# Altium schematic sheet [09] - ETHERNET.SchDoc
size A3; DocumentNumber: 9; SheetNumber: 9; SheetTotal: 18
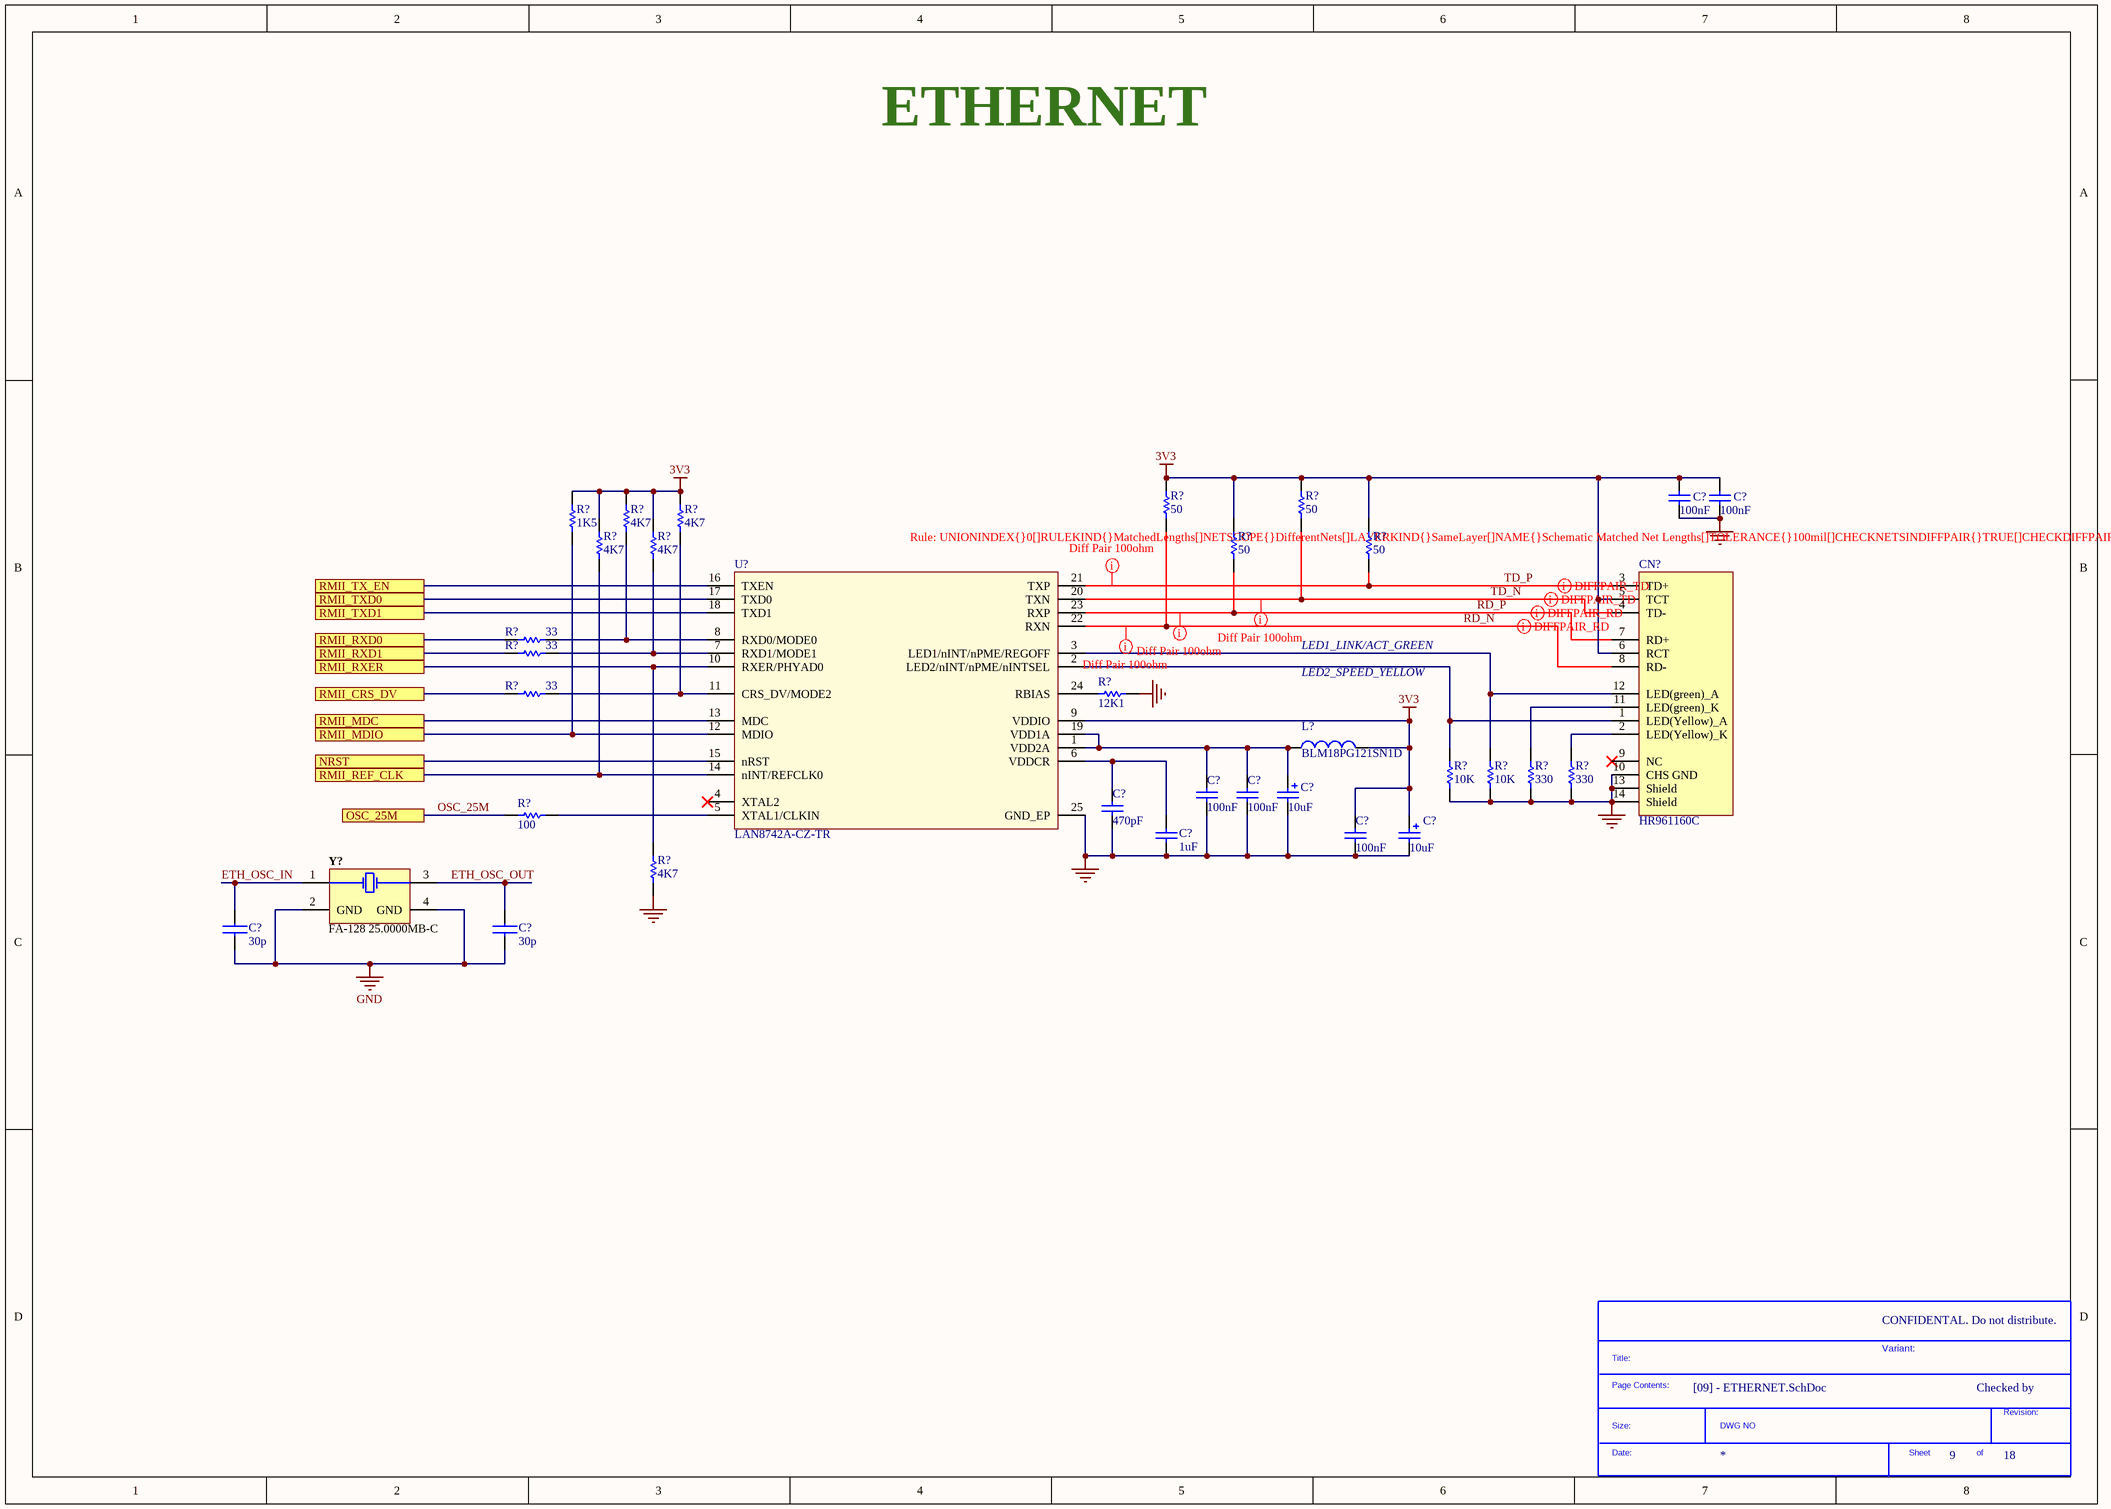
[diagram p0: [09] - ETHERNET.SchDoc]

## Parts
(Parts that share a designator on the sheet are numbered #1, #2 ... from top to bottom, then left to right.)
*  SDTitleBlock  (value not drawn)  (graphical)
C?#1  100nF  [0402C]
C?#2  100nF  [0402C]
C?#3  10uF  [TAN-A]
C?#4  100nF  [0402C]
C?#5  100nF  [0402C]
C?#6  470pF  [0402C]
C?#7  10uF  [TAN-A]
C?#8  1uF  [0603C]
C?#9  100nF  [0402C]
C?#10  30p  [C0402]
C?#11  30p  [C0402]
CN?  HR961160C  [RJ45_HR961160C]
L?  BLM18PG121SN1D  [0603L]
R?#1  50  [0402R]
R?#2  50  [0402R]
R?#3  1K5  [0402R]
R?#4  4K7  [0402R]
R?#5  4K7  [0402R]
R?#6  50  [0402R]
R?#7  50  [0402R]
R?#8  4K7  [0402R]
R?#9  4K7  [0402R]
R?#10  33  [0402R]
R?#11  33  [0402R]
R?#12  12K1  [0603R]
R?#13  33  [0402R]
R?#14  10K  [0402R]
R?#15  10K  [0402R]
R?#16  330  [0402R]
R?#17  330  [0402R]
R?#18  100  [0402R]
R?#19  4K7  [0402R]
U?  LAN8742A-CZ-TR  [QFN24_0R5_4X4]
Y?  FA-128 25.0000MB-C  [EPSON-FA-128_V]

## Ports
NRST, OSC_25M, RMII_CRS_DV, RMII_MDC, RMII_MDIO, RMII_REF_CLK, RMII_RXD0, RMII_RXD1, RMII_RXER, RMII_TX_EN, RMII_TXD0, RMII_TXD1

## Nets
3V3: C?#1.2 C?#2.2 C?#7.1 C?#9.2 CN?.5(TCT) CN?.6(RCT) L?.2 R?#1.1 R?#2.1 R?#3.2 R?#4.2 R?#5.2 R?#6.1 R?#7.1 R?#8.2 R?#9.2 U?.9(VDDIO)
GND: C?#1.1 C?#2.1 C?#3.2 C?#4.1 C?#5.1 C?#6.1 C?#7.2 C?#8.1 C?#9.1 C?#10.2 C?#11.2 CN?.10(CHS_GND) CN?.13(Shield) CN?.14(Shield) R?#12.2 R?#14.1 R?#15.1 R?#16.1 R?#17.1 R?#19.1 U?.25(GND_EP) Y?.2(GND) Y?.4(GND)
ETH_OSC_IN: C?#10.1 Y?.1(X1)
ETH_OSC_OUT: C?#11.1 Y?.3(X2)
NRST: U?.15(nRST) ; port NRST
OSC_25M: R?#18.1 ; port OSC_25M
RD_N: CN?.8(RD-) R?#1.2 U?.22(RXN)
RD_P: CN?.7(RD+) R?#6.2 U?.23(RXP)
RMII_CRS_DV: R?#13.2 ; port RMII_CRS_DV
RMII_MDC: U?.13(MDC) ; port RMII_MDC
RMII_MDIO: R?#3.1 U?.12(MDIO) ; port RMII_MDIO
RMII_REF_CLK: R?#8.1 U?.14(nINT/REFCLK0) ; port RMII_REF_CLK
RMII_RXD0: R?#10.2 ; port RMII_RXD0
RMII_RXD1: R?#11.2 ; port RMII_RXD1
RMII_RXER: R?#19.2 U?.10(RXER/PHYAD0) ; port RMII_RXER
RMII_TX_EN: U?.16(TXEN) ; port RMII_TX_EN
RMII_TXD0: U?.17(TXD0) ; port RMII_TXD0
RMII_TXD1: U?.18(TXD1) ; port RMII_TXD1
TD_N: CN?.4(TD-) R?#2.2 U?.20(TXN)
TD_P: CN?.3(TD+) R?#7.2 U?.21(TXP)
NetC?#3_1: C?#3.1 C?#4.2 C?#5.2 L?.1 U?.1(VDD2A) U?.19(VDD1A)
NetC?#6_2: C?#6.2 C?#8.2 U?.6(VDDCR)
NetCN?_1: CN?.1(LED(Yellow)_A) R?#14.2 U?.2(LED2/nINT/nPME/nINTSEL)
NetCN?_2: CN?.2(LED(Yellow)_K) R?#17.2
NetCN?_11: CN?.11(LED(green)_K) R?#16.2
NetCN?_12: CN?.12(LED(green)_A) R?#15.2 U?.3(LED1/nINT/nPME/REGOFF)
NetR?#4_1: R?#4.1 R?#10.1 U?.8(RXD0/MODE0)
NetR?#5_1: R?#5.1 R?#13.1 U?.11(CRS_DV/MODE2)
NetR?#9_1: R?#9.1 R?#11.1 U?.7(RXD1/MODE1)
NetR?#12_1: R?#12.1 U?.24(RBIAS)
NetR?#18_2: R?#18.2 U?.5(XTAL1/CLKIN)

Not connected (* = marked no-connect by the designer): CN? 9(NC)*; U? 4(XTAL2)*

## Layout directives
differential pair: RD_N, RD_P, TD_N, TD_P
rule Matched Net Lengths [Tolerance = 100mil]: RD_N, RD_P, TD_N, TD_P

## Notes on the sheet
- ETHERNET
- LED1_LINK/ACT_GREEN
- LED2_SPEED_YELLOW
- CONFIDENTAL. Do not distribute.
- CLOCKS (CPU & PCIE)
- Variant:
- Checked by
- (in symbol SDTitleBlock) Title:; Page Contents:; Revision:; Size:; DWG NO; Date:; Sheet; of

## Library data of the parts
C?#1 C?#2 C?#4 C?#5 C?#9 = Cap_100nF_X7R_10%_0402: Capacitor,100nF,16V,X7R,10%,0402,YAGEO; Manuf_Part_1: CC0402KRX7R7BB104; Revision: July-2002: Re-released for DXP Platform.; Value: 100nF; Order: CC0402KRX7R7BB104; Manuf_1: YAGEO
C?#3 C?#7 = Cap_10uF_POL_10%_TANA: Polarized Capacitor,10uF,10V,10%,typeA,VISHAY; Manuf_Part_1: 293D106X9010A2TE3; Revision: July-2002: Re-released for DXP Platform.; Value: 10uF; Manuf_1: VISHAY; Order: *; ECCN_US/EU: n/a
C?#6 = Cap_470pF_X7R_10%_0402: Capacitor,470pF,16V,X7R,10%,0402,YAGEO; Manuf_Part_1: 0402YC471KAT4A; Manuf_1: AVX; Revision: July-2002: Re-released for DXP Platform.; Value: 470pF; Order: 0402YC471KAT4A; ECCN_US/EU: n/a
C?#8 = Cap_1uF_X5R_10%_0603: Capacitor,1uF,16V,X5R,10%,0603,YAGEO; Manuf_Part_1: CC0603KRX5R7BB105; Revision: July-2002: Re-released for DXP Platform.; Value: 1uF; Order: CC0603KRX5R7BB105; Manuf_1: YAGEO; ECCN_US/EU: n/a
C?#10 C?#11 = C1005C0G1H180J: CAP CER 18PF 50V C0G 5% 0402; Manufacturer: TDK Corporation; .Checked PCB: used; Temperature Coefficient: C0G, NP0; Capacitance: 18pF; Category: Capacitors; Supplier Part Number: 445-1238-1-ND; Manufacturer Part Number: C1005C0G1H180J; Operating Temperature: -55°C ~ 125°C; Package / Case: 0402 (1005 Metric); Price 1k [$]: 0.00468; Value: 18pF; .Checked SCH: used; Voltage - Rated: 50V; Supplier: Digikey; Supplier 1: Digi-Key; Supplier Part Number 1: 445-1238-1-ND; RoHS: RoHS Compliant; Stock 1: 24321; Pricing 1: 1=0.08, 10=0.05, 100=0.018, 250=0.013, 500=0.0096, 1000=0.0065 (USD); Tolerance: ±5%; Mounting Type: Surface Mount, MLCC; Applications: General Purpose; Ratings: -; Size / Dimension: 0.039" L x 0.020" W (1.00mm x 0.50mm); Height - Seated (Max): -; Thickness (Max): 0.022" (0.55mm); Lead Spacing: -; Features: -; Packaging: Cut Tape (CT); Lead Style: -; ComponentLink1URL: http://www.tdk.co.jp/tefe02/e412_c.pdf; ComponentLink1Description: http://www.tdk.co.jp/tefe02/e412_c.pdf
CN? = HR961160C: 100 Base-TX (Fast Ethernet) SMD RJ45 single port (1x1) with LEDS Integrated Magnetics Connector; Manuf_1: HanRun; Manuf_2: Pulse Electronics Corporation; Manuf_Part_2: J3011G21DNLT; Manuf_3: K.O.D International Holding; Manuf_Part_3: RMT-119A-12F6-GY-04; Distrib: Sub Co; Manuf_Part_1: HR961160C; Order: *
L? = BEAD_120R_2A_0603: Bead,120R,2A,0603,BLM18PG121SN1D,MURATA; Manuf_Part_3: FCM1608KF-601T03; Manuf_2: TDK; Manuf_Part_2: MPZ1608S300A; Manuf_3: Tai-tech; Value: 100uH; Description_3: Bead,600R,350mA,0603,FCM1608KF-601T03,Tai-tech; Description_2: Bead,30R,5A,0603,MPZ1608S300A,TDK; Revision: July-2002: Re-released for DXP Platform.; ECCN_US/EU: n/a; Manuf_Part_1: BLM18PG121SN1D; Manuf_1: MURATA
R?#1 R?#2 R?#6 R?#7 = Res_50_1%_0402: Resistor,50,0402,1%,YAGEO; Manuf_Part_1: RC0402FR-0749R9L; Value: 49.9; Manuf_1: YAGEO; Order: *; ECCN_US/EU: n/a; Distrib: FARNELL
R?#3 = Res_1K5_1%_0402: Resistor,1K5,0402,1%,YAGEO; Manuf_Part_1: RC0402FR-071K5L; Value: 1K5; Manuf_1: YAGEO; Order: RC0402FR-071K5L; ECCN_US/EU: n/a; Distrib: FARNELL
R?#4 R?#5 R?#8 R?#9 R?#19 = Res_4K7_1%_0402: Resistor,4K7,0402,1%,YAGEO; Manuf_Part_1: RT0402FRE074K7L; Value: 4K7; Manuf_1: YAGEO; Order: RT0402FRE074K7L; ECCN_US/EU: n/a
R?#10 R?#11 R?#13 = Res_33_1%_0402: Resistor,33,0402,1%,YAGEO; Manuf_Part_1: RC0402FR-0733RL; Value: 33; Manuf_1: YAGEO; Order: *; ECCN_US/EU: n/a; Distrib: FARNELL
R?#12 = Res_12K1_1%_0603: Resistor,12K1,0603,1%,VISHAY; Manuf_Part_1: MCT 0603-50 1% P5 12K1; Order: 2325243; Value: 12K1; ECCN_US/EU: n/a; Manuf_1: VISHAY; Distrib: FARNELL
R?#14 R?#15 = Res_10K_1%_0402: Resistor,10K,0402,1%,YAGEO; Manuf_Part_1: RC0402FR-0710KL; Value: 10K; Manuf_1: YAGEO; Order: RC0402FR-0710KL; ECCN_US/EU: n/a
R?#16 R?#17 = Res_330_1%_0402: Resistor,330,0402,1%,YAGEO; Manuf_Part_1: RC0402FR-07330RL; Value: 330; ECCN_US/EU: n/a; Manuf_1: YAGEO; Distrib: DIGIKEY; Order: RC0402FR-07330RL
R?#18 = Res_100_1%_0402: Resistor,100,0402,1%,YAGEO; Manuf_Part_1: RC0402FR-07100RL; Order: 9239111; Value: 100; Manuf_1: YAGEO; ECCN_US/EU: n/a; Distrib: FARNELL
U? = LAN8742A-CZ-TR: LAN8742A-CZ-TR - Small Footprint RMII 10/100 Ethernet, Transceiver with HP Auto-MDIX and flexPWR Technology SQFN-24; Manuf_1: MICROCHIP; Order: LAN8742A-CZ-TR; Manuf_Part_1: LAN8742A-CZ-TR; Distrib: MICROCHIP
Y? = CMP-1695-00001-3: Range Crystal Unit, 25 MHz, -40 to 85 degC, 4-Pin SMD, RoHS, Tape and Reel; ComponentLink2Description: Datasheet; Mounting Technology: Surface Mount; PackageDescription: 4-Pin Surface Mount Device, Body 1.6 x 2 mm, Pitch 1.45 mm; ComponentLink1URL: https://www.eea.epson.com/; DatasheetVersion: Rev. Feb-15; ComponentLink2URL: https://support.epson.biz/td/api/doc_check.php?dl=brief_FA-128_en.pdf; ComponentLink1Description: Manufacturer URL; PartNumber: FA-128 25.0000MB-C